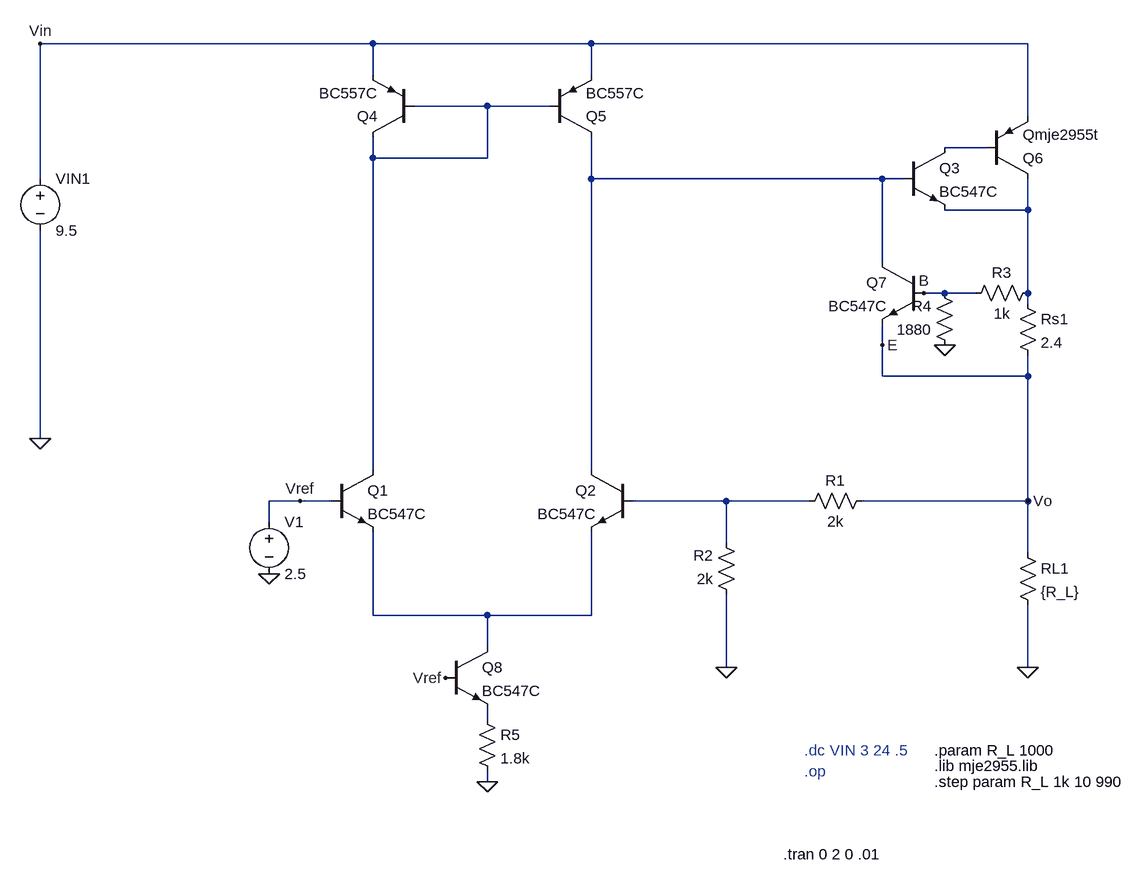
[diagram p0: schematic Draft4.asc]
Draft4.asc, the LTspice schematic file:
Version 4.1
SHEET 1 1096 848
WIRE -208 -416 -720 -416
WIRE 128 -416 -208 -416
WIRE 800 -416 128 -416
WIRE -208 -368 -208 -416
WIRE 128 -368 128 -416
WIRE -32 -320 -144 -320
WIRE 64 -320 -32 -320
WIRE 800 -304 800 -416
WIRE 736 -256 672 -256
WIRE -208 -240 -208 -272
WIRE -32 -240 -32 -320
WIRE -32 -240 -208 -240
WIRE -720 -208 -720 -416
WIRE 128 -208 128 -272
WIRE 576 -208 128 -208
WIRE 608 -208 576 -208
WIRE 800 -160 800 -208
WIRE 800 -160 672 -160
WIRE 576 -80 576 -208
WIRE 672 -32 640 -32
WIRE 720 -32 672 -32
WIRE 800 -32 800 -160
WIRE 800 -16 800 -32
WIRE 576 48 576 16
WIRE 576 96 576 48
WIRE 800 96 800 64
WIRE 800 96 576 96
WIRE -720 192 -720 -128
WIRE -208 240 -208 -240
WIRE 128 240 128 -208
WIRE -320 288 -368 288
WIRE -272 288 -320 288
WIRE 336 288 192 288
WIRE 464 288 336 288
WIRE 800 288 800 96
WIRE 800 288 544 288
WIRE -368 320 -368 288
WIRE 336 352 336 288
WIRE 800 368 800 288
WIRE -208 464 -208 336
WIRE -32 464 -208 464
WIRE 128 464 128 336
WIRE 128 464 -32 464
WIRE -32 512 -32 464
WIRE 336 544 336 432
WIRE 800 544 800 448
WIRE -32 624 -32 608
WIRE -32 720 -32 704
FLAG -368 400 0
FLAG 800 544 0
FLAG -720 192 0
FLAG 336 544 0
FLAG 800 288 Vo
FLAG 672 48 0
FLAG 640 -32 B
FLAG 576 48 E
FLAG -320 288 Vref
FLAG -96 560 Vref
FLAG -32 720 0
FLAG -720 -416 Vin
SYMBOL npn -272 240 R0
SYMATTR InstName Q1
SYMATTR Value BC547C
SYMBOL npn 192 240 M0
SYMATTR InstName Q2
SYMATTR Value BC547C
SYMBOL npn 608 -256 R0
SYMATTR InstName Q3
SYMATTR Value BC547C
SYMBOL pnp -144 -272 R180
SYMATTR InstName Q4
SYMATTR Value BC557C
SYMBOL pnp 64 -272 M180
SYMATTR InstName Q5
SYMATTR Value BC557C
SYMBOL voltage -368 304 R0
WINDOW 123 0 0 Left 0
WINDOW 39 0 0 Left 0
SYMATTR InstName V1
SYMATTR Value 2.5
SYMBOL voltage -720 -224 R0
WINDOW 123 0 0 Left 0
WINDOW 39 0 0 Left 0
SYMATTR InstName VIN1
SYMATTR Value 9.5
SYMBOL pnp 736 -208 M180
SYMATTR InstName Q6
SYMATTR Value Qmje2955t
SYMBOL res 784 352 R0
SYMATTR InstName RL1
SYMATTR Value {R_L}
SYMBOL res 560 272 R90
WINDOW 0 0 56 VBottom 2
WINDOW 3 32 56 VTop 2
SYMATTR InstName R1
SYMATTR Value 2k
SYMBOL res 352 448 R180
WINDOW 0 36 76 Left 2
WINDOW 3 36 40 Left 2
SYMATTR InstName R2
SYMATTR Value 2k
SYMBOL npn 640 -80 M0
SYMATTR InstName Q7
SYMATTR Value BC547C
SYMBOL res 784 -32 R0
SYMATTR InstName Rs1
SYMATTR Value 2.4
SYMBOL res 816 -48 R90
WINDOW 0 0 56 VBottom 2
WINDOW 3 32 56 VTop 2
SYMATTR InstName R3
SYMATTR Value 1k
SYMBOL res 688 64 R180
WINDOW 0 36 76 Left 2
WINDOW 3 36 40 Left 2
SYMATTR InstName R4
SYMATTR Value 1880
SYMBOL npn -96 512 R0
SYMATTR InstName Q8
SYMATTR Value BC547C
SYMBOL res -48 608 R0
SYMATTR InstName R5
SYMATTR Value 1.8k
TEXT 656 672 Left 2 !.param R_L 1000
TEXT 656 696 Left 2 !.lib mje2955.lib
TEXT 456 672 Left 2 ;.dc VIN 3 24 .5
TEXT 656 720 Left 2 !.step param R_L 1k 10 990
TEXT 456 704 Left 2 ;.op
TEXT 424 832 Left 2 !.tran 0 2 0 .01

The netlist it stands for:
* Draft4.asc
Q1 N001 Vref N006 0 BC547C
Q2 N003 N005 N006 0 BC547C
Q3 N002 N003 N004 0 BC547C
Q4 N001 N001 Vin 0 BC557C
Q5 N003 N001 Vin 0 BC557C
V1 Vref 0 2.5
VIN1 Vin 0 9.5
Q6 N004 N002 Vin 0 Qmje2955t
RL1 E 0 {R_L}
R1 E N005 2k
R2 0 N005 2k
Q7 N003 B E 0 BC547C
Rs1 N004 E 2.4
R3 N004 B 1k
R4 0 B 1880
Q8 N006 Vref N007 0 BC547C
R5 N007 0 1.8k
.model NPN NPN
.model PNP PNP
.lib standard.bjt
.param R_L 1000
.lib mje2955.lib
* .dc VIN 3 24 .5
.step param R_L 1k 10 990
* .op
.tran 0 2 0 .01
.backanno
.end